# EAGLE design core v1-1 (EAGLE 6.1)

## Sheet 1 of 3
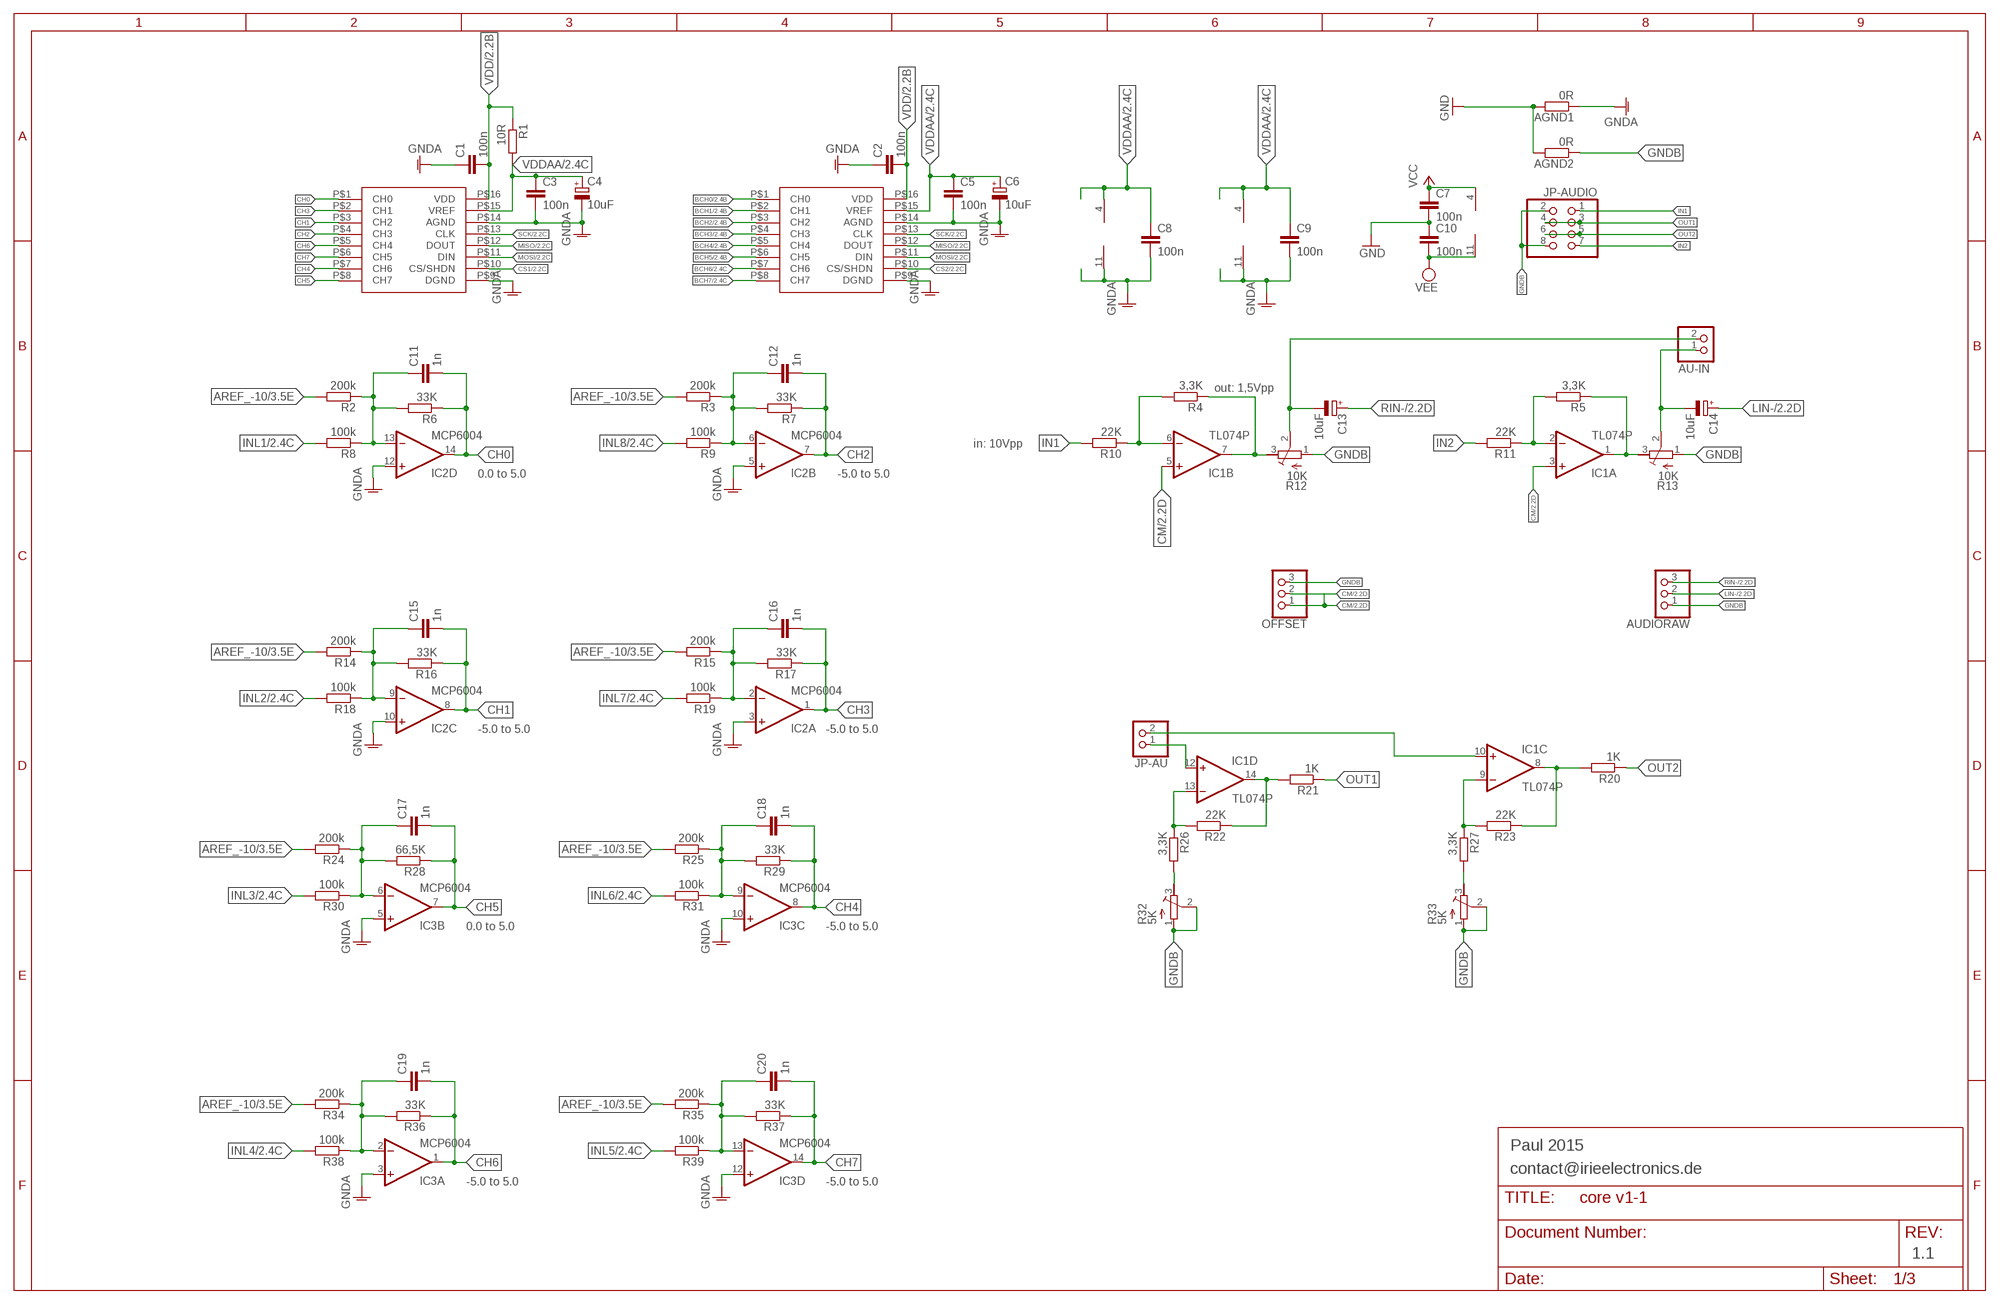
[diagram p0: schematic, sheet 1]

### Parts
AGND1  0R  R-EU_0207/7  [0207/7]
AGND2  0R  R-EU_0207/7  [0207/7]
AU-IN  PINHD-1X2_2.54-SMD-90°  [1X02SMD/90]
AUDIORAW  PINHD-1X3_2.54-SMD-90°  [1X03SMD/90]
C1  100n  C-EU025-025X050  [C025-025X050]
C2  100n  C-EU025-025X050  [C025-025X050]
C3  100n  C-EU025-025X050  [C025-025X050]
C4  10uF  CPOL-EUE1.8-4  [E1,8-4]
C5  100n  C-EU025-025X050  [C025-025X050]
C6  10uF  CPOL-EUE1.8-4  [E1,8-4]
C7  100n  C-EU025-025X050  [C025-025X050]
C8  100n  C-EU025-025X050  [C025-025X050]
C9  100n  C-EU025-025X050  [C025-025X050]
C10  100n  C-EU025-025X050  [C025-025X050]
C11  1n  C-EU050-025X075  [C050-025X075]
C12  1n  C-EU050-025X075  [C050-025X075]
C13  10uF  CPOL-EUE1.8-4  [E1,8-4]
C14  10uF  CPOL-EUE1.8-4  [E1,8-4]
C15  1n  C-EU050-025X075  [C050-025X075]
C16  1n  C-EU050-025X075  [C050-025X075]
C17  1n  C-EU050-025X075  [C050-025X075]
C18  1n  C-EU050-025X075  [C050-025X075]
C19  1n  C-EU050-025X075  [C050-025X075]
C20  1n  C-EU050-025X075  [C050-025X075]
IC1  TL074P  [DIL14]
IC2  MCP6004  TL074P  [DIL14]
IC3  MCP6004  TL074P  [DIL14]
JP-AU  PINHD-1X2_2.54  [1X02]
JP-AUDIO  PINHD-2X4_2.54  [2X04]
OFFSET  PINHD-1X3_2.54-SMD-90°  [1X03SMD/90]
R1  10R  R-EU_0207/7  [0207/7]
R2  200k  R-EU_0207/7  [0207/7]
R3  200k  R-EU_0207/7  [0207/7]
R4  3,3K  R-EU_0207/7  [0207/7]
R5  3,3K  R-EU_0207/7  [0207/7]
R6  33K  R-EU_0207/7  [0207/7]
R7  33K  R-EU_0207/7  [0207/7]
R8  100k  R-EU_0207/7  [0207/7]
R9  100k  R-EU_0207/7  [0207/7]
R10  22K  R-EU_0207/7  [0207/7]
R11  22K  R-EU_0207/7  [0207/7]
R12  10K  R-TRIMM3296P  [RTRIM3296P]
R13  10K  R-TRIMM3296P  [RTRIM3296P]
R14  200k  R-EU_0207/7  [0207/7]
R15  200k  R-EU_0207/7  [0207/7]
R16  33K  R-EU_0207/7  [0207/7]
R17  33K  R-EU_0207/7  [0207/7]
R18  100k  R-EU_0207/7  [0207/7]
R19  100k  R-EU_0207/10  [0207/10]
R20  1K  R-EU_0207/7  [0207/7]
R21  1K  R-EU_0207/7  [0207/7]
R22  22K  R-EU_0207/10  [0207/10]
R23  22K  R-EU_0207/7  [0207/7]
R24  200k  R-EU_0207/10  [0207/10]
R25  200k  R-EU_0207/7  [0207/7]
R26  3,3K  R-EU_0207/10  [0207/10]
R27  3,3K  R-EU_0207/7  [0207/7]
R28  66,5K  R-EU_0207/7  [0207/7]
R29  33K  R-EU_0207/7  [0207/7]
R30  100k  R-EU_0207/7  [0207/7]
R31  100k  R-EU_0207/7  [0207/7]
R32  5K  R-TRIMM3296P  [RTRIM3296P]
R33  5K  R-TRIMM3296P  [RTRIM3296P]
R34  200k  R-EU_0207/10  [0207/10]
R35  200k  R-EU_0207/7  [0207/7]
R36  33K  R-EU_0207/7  [0207/7]
R37  33K  R-EU_0207/7  [0207/7]
R38  100k  R-EU_0207/7  [0207/7]
R39  100k  R-EU_0207/7  [0207/7]
U$1  MCP3208_DIP  [MCP2308]
U$2  MCP3208_DIP  [MCP2308]

### Nets
AREF_-10: R2.2 R3.2 R14.2 R15.2 R24.2 R25.2 R34.2 R35.2 ; also sheet 3
BCH0: U$2.P$1(CH0) ; also sheet 2
BCH1: U$2.P$2(CH1) ; also sheet 2
BCH2: U$2.P$3(CH2) ; also sheet 2
BCH3: U$2.P$4(CH3) ; also sheet 2
BCH4: U$2.P$5(CH4) ; also sheet 2
BCH5: U$2.P$6(CH5) ; also sheet 2
BCH6: U$2.P$7(CH6) ; also sheet 2
BCH7: U$2.P$8(CH7) ; also sheet 2
CH0: C11.2 IC2.14(D:OUT) R6.1 U$1.P$1(CH0)
CH1: C15.2 IC2.8(C:OUT) R16.1 U$1.P$3(CH2)
CH2: C12.2 IC2.7(B:OUT) R7.1 U$1.P$4(CH3)
CH3: C16.2 IC2.1(A:OUT) R17.1 U$1.P$2(CH1)
CH4: C18.2 IC3.8(C:OUT) R29.1 U$1.P$7(CH6)
CH5: C17.2 IC3.7(B:OUT) R28.1 U$1.P$8(CH7)
CH6: C19.2 IC3.1(A:OUT) R36.1 U$1.P$5(CH4)
CH7: C20.2 IC3.14(D:OUT) R37.1 U$1.P$6(CH5)
CM: IC1.3(A:+IN) IC1.5(B:+IN) OFFSET.1 OFFSET.2 ; also sheet 2
CS1: U$1.P$10(CS/SHDN) ; also sheet 2
CS2: U$2.P$10(CS/SHDN) ; also sheet 2
GND: AGND1.2 AGND2.2 C7.2 C10.1 ; also sheet 2,3
GNDA: AGND1.1 C1.1 C2.1 C3.2 C4.- C5.2 C6.- C8.2 C9.2 IC2.3(A:+IN) IC2.5(B:+IN) IC2.10(C:+IN) IC2.11(P:V-) IC2.12(D:+IN) IC3.3(A:+IN) IC3.5(B:+IN) IC3.10(C:+IN) IC3.11(P:V-) IC3.12(D:+IN) U$1.P$9(DGND) U$1.P$14(AGND) U$2.P$9(DGND) U$2.P$14(AGND) ; also sheet 2,3
GNDB: AGND2.1 AUDIORAW.1 JP-AUDIO.2 JP-AUDIO.8 OFFSET.3 R12.1(E) R13.1(E) R32.1(E) R32.2(S) R33.1(E) R33.2(S)
IN1: JP-AUDIO.1 R10.2
IN2: JP-AUDIO.7 R11.2
INL1: R8.2 ; also sheet 2
INL2: R18.2 ; also sheet 2
INL3: R30.2 ; also sheet 2
INL4: R38.2 ; also sheet 2
INL5: R39.2 ; also sheet 2
INL6: R31.2 ; also sheet 2
INL7: R19.2 ; also sheet 2
INL8: R9.2 ; also sheet 2
LIN-: AUDIORAW.2 C14.+ ; also sheet 2
MISO: U$1.P$12(DOUT) U$2.P$12(DOUT) ; also sheet 2
MOSI: U$1.P$11(DIN) U$2.P$11(DIN) ; also sheet 2
N$2: C15.1 IC2.9(C:-IN) R14.1 R16.2 R18.1
N$4: R26.2 R32.3(A)
N$5: C16.1 IC2.2(A:-IN) R15.1 R17.2 R19.1
N$6: IC1.13(D:-IN) R22.2 R26.1
N$7: IC1.14(D:OUT) R21.2 R22.1
N$8: AU-IN.2 C13.- R12.2(S)
N$9: R27.2 R33.3(A)
N$10: IC1.9(C:-IN) R23.2 R27.1
N$11: C11.1 IC2.13(D:-IN) R2.1 R6.2 R8.1
N$12: IC1.8(C:OUT) R20.2 R23.1
N$13: IC1.10(C:+IN) JP-AU.2
N$14: IC1.12(D:+IN) JP-AU.1
N$15: C12.1 IC2.6(B:-IN) R3.1 R7.2 R9.1
N$16: AU-IN.1 C14.- R13.2(S)
N$17: IC1.6(B:-IN) R4.2 R10.1
N$18: C19.1 IC3.2(A:-IN) R34.1 R36.2 R38.1
N$19: IC1.7(B:OUT) R4.1 R12.3(A)
N$20: C20.1 IC3.13(D:-IN) R35.1 R37.2 R39.1
N$21: IC1.2(A:-IN) R5.2 R11.1
N$22: C17.1 IC3.6(B:-IN) R24.1 R28.2 R30.1
N$23: IC1.1(A:OUT) R5.1 R13.3(A)
N$24: C18.1 IC3.9(C:-IN) R25.1 R29.2 R31.1
OUT1: JP-AUDIO.3 JP-AUDIO.4 R21.1
OUT2: JP-AUDIO.5 JP-AUDIO.6 R20.1
RIN-: AUDIORAW.3 C13.+ ; also sheet 2
SCK: U$1.P$13(CLK) U$2.P$13(CLK) ; also sheet 2
VCC: C7.1 IC1.4(P:V+) ; also sheet 3
VDD: C1.2 C2.2 R1.1 U$1.P$16(VDD) U$2.P$16(VDD) ; also sheet 2
VDDAA: C3.1 C4.+ C5.1 C6.+ C8.1 C9.1 IC2.4(P:V+) IC3.4(P:V+) R1.2 U$1.P$15(VREF) U$2.P$15(VREF) ; also sheet 2
VEE: C10.2 IC1.11(P:V-) ; also sheet 3

### Notes on the sheet
- out: 1,5Vpp
- in: 10Vpp
- 0.0 to 5.0 | -5.0 to 5.0
- -5.0 to 5.0 | -5.0 to 5.0
- 0.0 to 5.0 | -5.0 to 5.0
- Paul 2015
- contact@irieelectronics.de
- -5.0 to 5.0 | -5.0 to 5.0
- 1.1

## Sheet 2 of 3
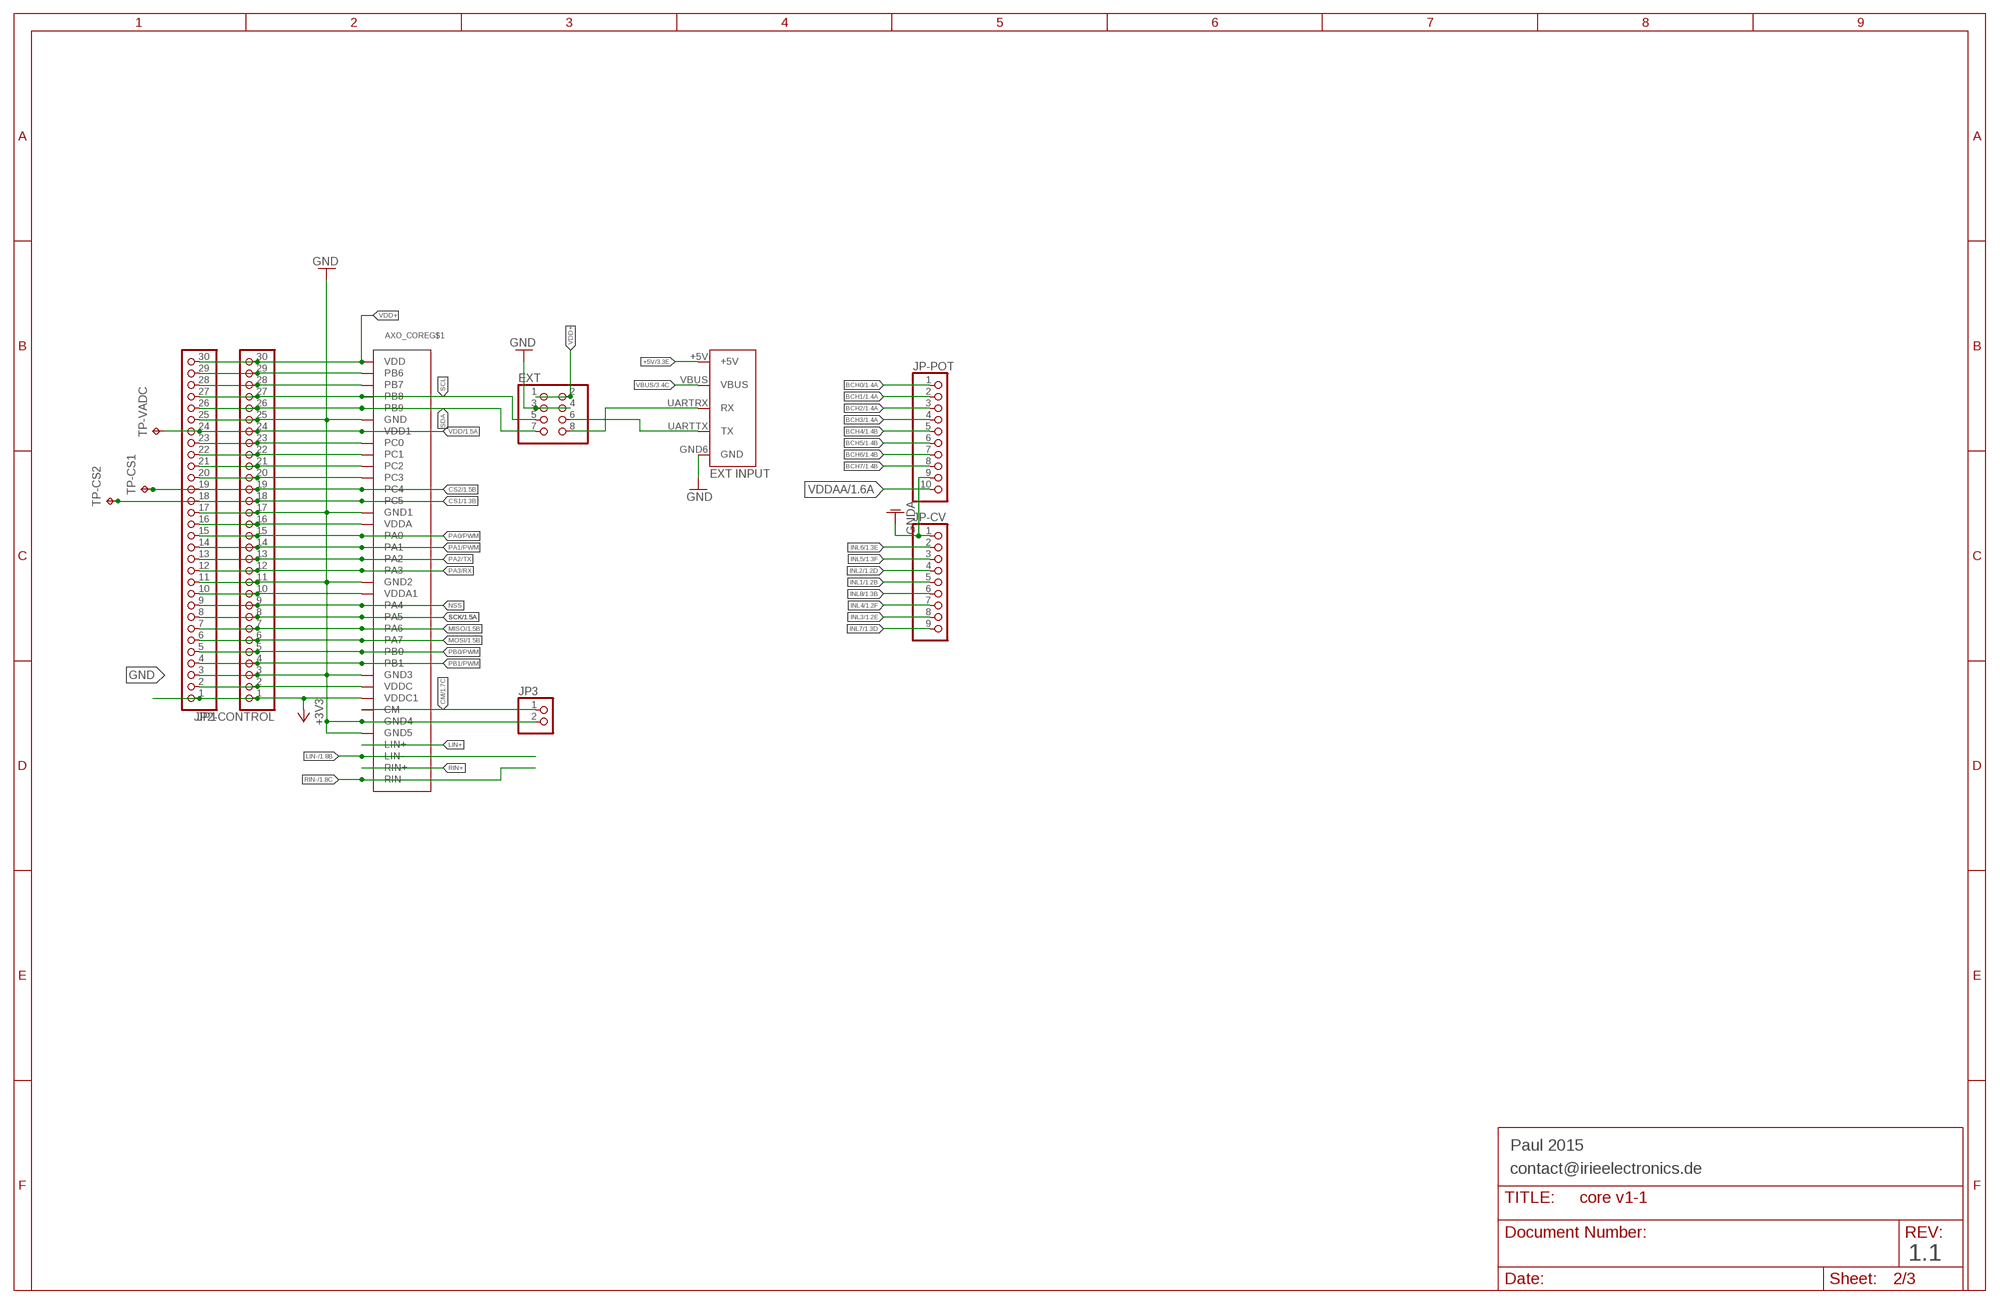
[diagram p1: schematic, sheet 2]

### Parts
AXO_CORE  AXO-CORE  AXOLOTI-CORE  [AXOLOTI-CORE]
EXT  PINHD-2X4_2.54  [2X04]
JP1  PINHD-1X30  [1X30]
JP2-CONTROL  PINHD-1X30  [1X30]
JP3  PINHD-1X2_2.54  [1X02]
JP-CV  PINHD-1X9_2.54  [1X09]
JP-POT  PINHD-1X10_2.54  [1X10]
TP-CS1  TPTP10R  [TP10R]
TP-CS2  TPTP10R  [TP10R]
TP-VADC  TPTP10R  [TP10R]

### Nets
+3V3: AXO_CORE.VDDC1 JP1.1 JP2-CONTROL.1
+5V: AXO_CORE.+5V ; also sheet 3
BCH0: JP-POT.1 ; also sheet 1
BCH1: JP-POT.2 ; also sheet 1
BCH2: JP-POT.3 ; also sheet 1
BCH3: JP-POT.4 ; also sheet 1
BCH4: JP-POT.5 ; also sheet 1
BCH5: JP-POT.6 ; also sheet 1
BCH6: JP-POT.7 ; also sheet 1
BCH7: JP-POT.8 ; also sheet 1
CM: AXO_CORE.CM JP3.1 ; also sheet 1
CS1: AXO_CORE.PC5 JP1.18 JP2-CONTROL.18 TP-CS2.TP ; also sheet 1
CS2: AXO_CORE.PC4 JP1.19 JP2-CONTROL.19 TP-CS1.TP ; also sheet 1
GND: AXO_CORE.GND AXO_CORE.GND1 AXO_CORE.GND2(GND3) AXO_CORE.GND3(GND2) AXO_CORE.GND4 AXO_CORE.GND5 AXO_CORE.GND6(GND) EXT.3 EXT.4 JP1.3 JP1.11 JP1.17 JP1.25 JP2-CONTROL.3 JP2-CONTROL.11 JP2-CONTROL.17 JP2-CONTROL.25 JP3.2 ; also sheet 1,3
GNDA: JP-CV.1 JP-POT.9 ; also sheet 1,3
INL1: JP-CV.5 ; also sheet 1
INL2: JP-CV.4 ; also sheet 1
INL3: JP-CV.8 ; also sheet 1
INL4: JP-CV.7 ; also sheet 1
INL5: JP-CV.3 ; also sheet 1
INL6: JP-CV.2 ; also sheet 1
INL7: JP-CV.9 ; also sheet 1
INL8: JP-CV.6 ; also sheet 1
LIN+: AXO_CORE.LIN+
LIN-: AXO_CORE.LIN- ; also sheet 1
MIDI/RX: AXO_CORE.UARTRX(RX) EXT.8
MIDI/TX: AXO_CORE.UARTTX(TX) EXT.6
MISO: AXO_CORE.PA6 JP1.7 JP2-CONTROL.7 ; also sheet 1
MOSI: AXO_CORE.PA7 JP1.6 JP2-CONTROL.6 ; also sheet 1
N$29: AXO_CORE.VDDC JP1.2 JP2-CONTROL.2
N$32: AXO_CORE.VDDA1 JP1.10 JP2-CONTROL.10
N$38: AXO_CORE.VDDA JP1.16 JP2-CONTROL.16
N$42: AXO_CORE.PC3 JP1.20 JP2-CONTROL.20
N$43: AXO_CORE.PC2 JP1.21 JP2-CONTROL.21
N$44: AXO_CORE.PC1 JP1.22 JP2-CONTROL.22
N$45: AXO_CORE.PC0 JP1.23 JP2-CONTROL.23
N$50: AXO_CORE.PB7 JP1.28 JP2-CONTROL.28
N$51: AXO_CORE.PB6 JP1.29 JP2-CONTROL.29
NSS: AXO_CORE.PA4 JP1.9 JP2-CONTROL.9
PA0/PWM: AXO_CORE.PA0 JP1.15 JP2-CONTROL.15
PA1/PWM: AXO_CORE.PA1 JP1.14 JP2-CONTROL.14
PA2/TX: AXO_CORE.PA2 JP1.13 JP2-CONTROL.13
PA3/RX: AXO_CORE.PA3 JP1.12 JP2-CONTROL.12
PB0/PWM: AXO_CORE.PB0 JP1.5 JP2-CONTROL.5
PB1/PWM: AXO_CORE.PB1 JP1.4 JP2-CONTROL.4
RIN+: AXO_CORE.RIN+
RIN-: AXO_CORE.RIN- ; also sheet 1
SCK: AXO_CORE.PA5 JP1.8 JP2-CONTROL.8 ; also sheet 1
SCL: AXO_CORE.PB8 EXT.5 JP1.27 JP2-CONTROL.27
SDA: AXO_CORE.PB9 EXT.7 JP1.26 JP2-CONTROL.26
VBUS: AXO_CORE.VBUS ; also sheet 3
VDD: AXO_CORE.VDD1 JP1.24 JP2-CONTROL.24 TP-VADC.TP ; also sheet 1
VDD+: AXO_CORE.VDD EXT.1 EXT.2 JP1.30 JP2-CONTROL.30
VDDAA: JP-POT.10 ; also sheet 1

### Notes on the sheet
- Paul 2015
- contact@irieelectronics.de
- 1.1

## Sheet 3 of 3
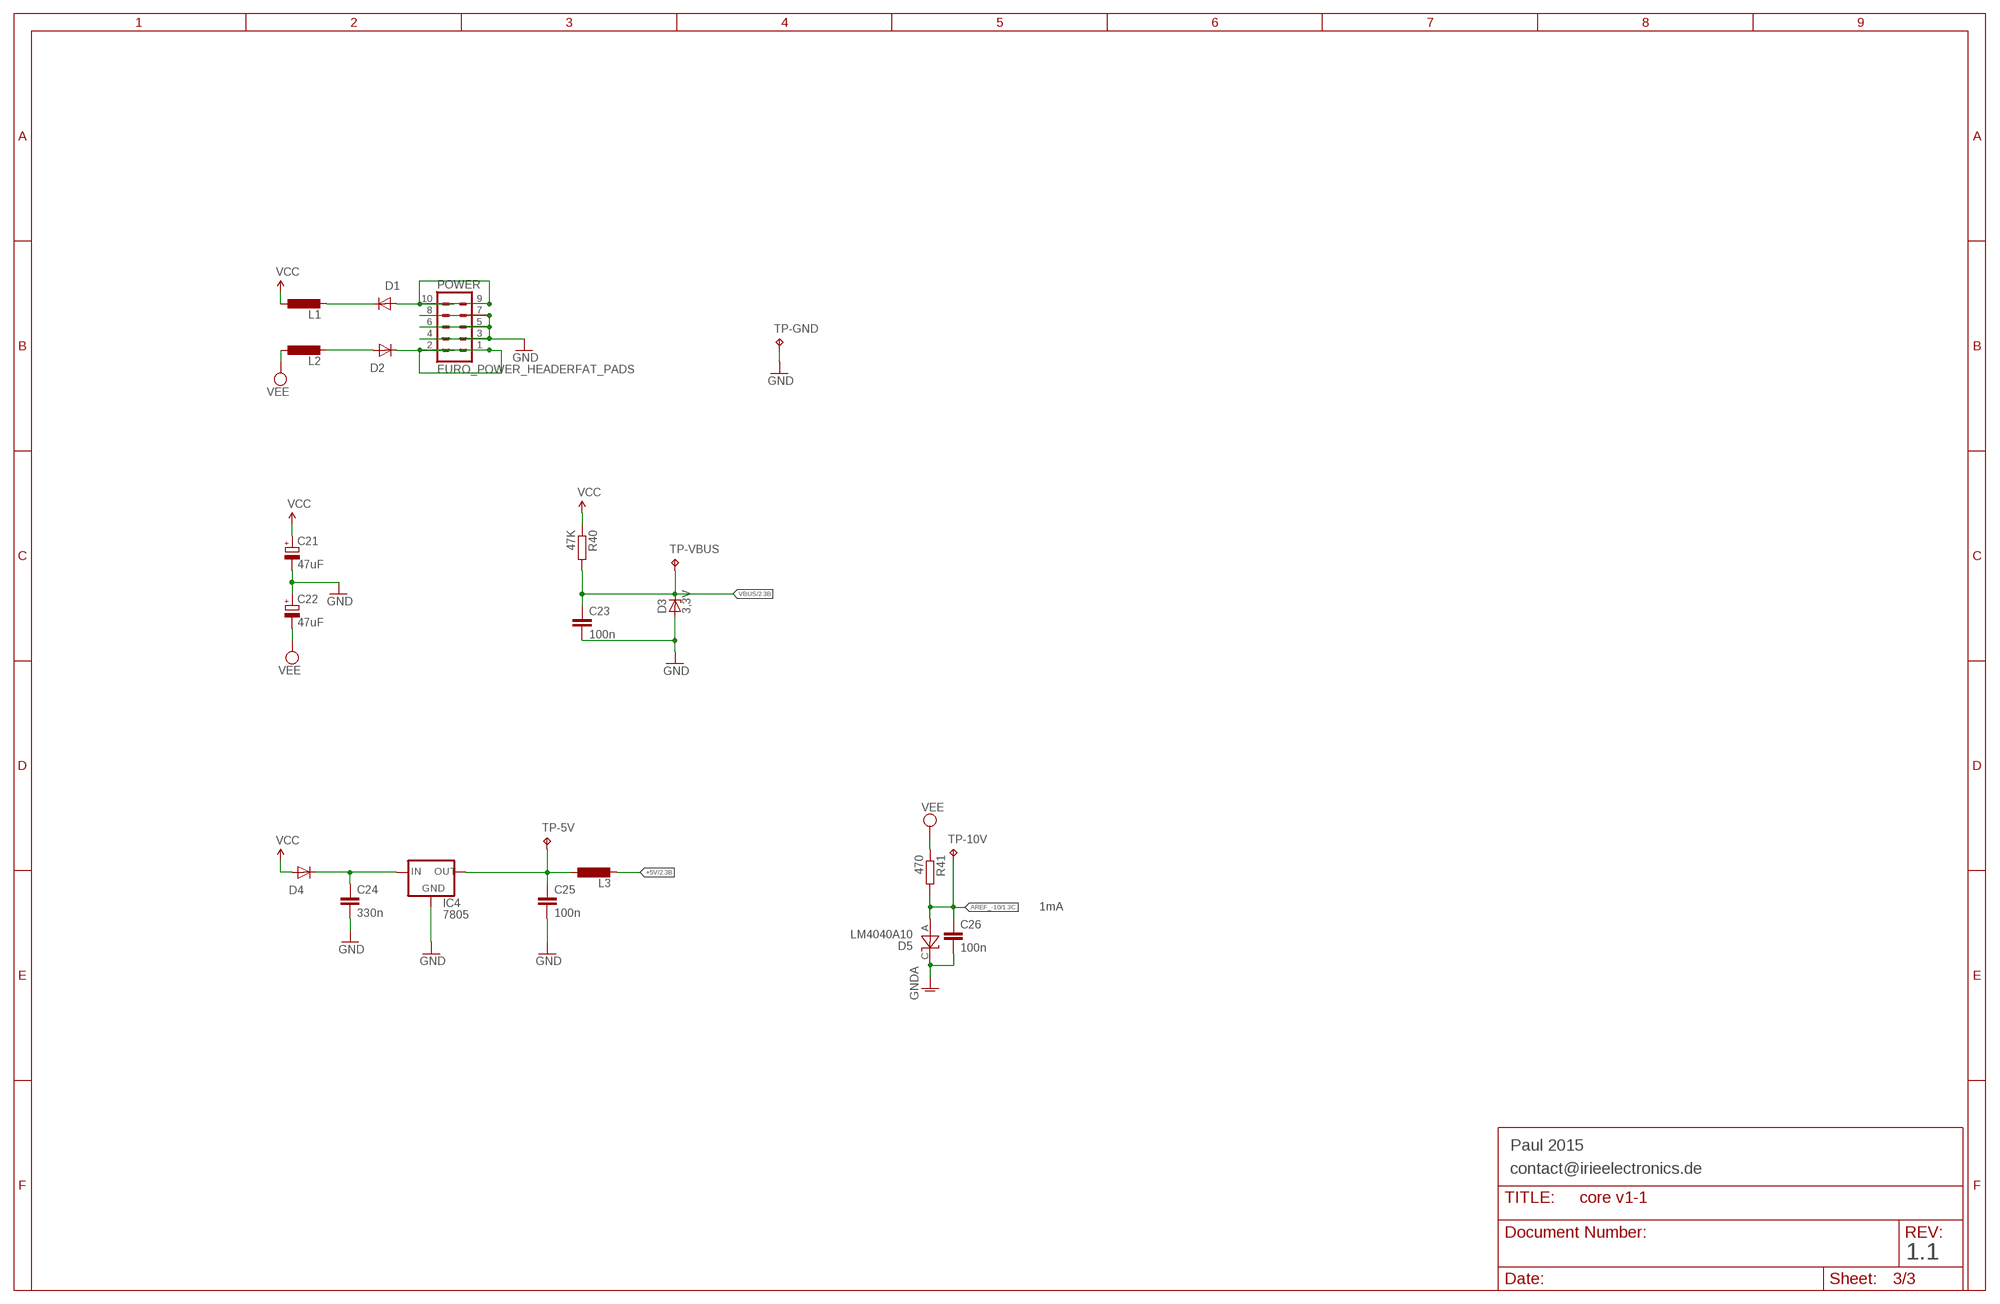
[diagram p2: schematic, sheet 3]

### Parts
C21  47uF  CPOL-EUE2-5  [E2-5]
C22  47uF  CPOL-EUE2-5  [E2-5]
C23  100n  C-EU025-025X050  [C025-025X050]
C24  330n  C-EU025-025X050  [C025-025X050]
C25  100n  C-EU025-025X050  [C025-025X050]
C26  100n  C-EU025-025X050  [C025-025X050]
D1  1N5819  1N4148DO35-10  [DO35-10]
D2  1N5819  1N4148DO35-10  [DO35-10]
D3  3,3V  1N821  [DO35Z10]
D4  1N5819HW  1N4148DO35-10  [DO35-10]
D5  LM4040A10  LM4040DIP  [TO-92]
IC4  7805  78MXXS  [78MXXS]
L1  L-EU0207/10  [0207/10]
L2  L-EU0207/10  [0207/10]
L3  L-EU0207/10  [0207/10]
POWER  EURO_POWER_HEADERFAT_PADS  [EURO_PWR_HEADER_FAT]
R40  47K  R-EU_0207/7  [0207/7]
R41  470  R-EU_0207/10  [0207/10]
TP-5V  TPTP10R  [TP10R]
TP-10V  TPTP10R  [TP10R]
TP-GND  TPPAD1-13  [P1-13]
TP-VBUS  TPTP10R  [TP10R]

### Nets
+5V: L3.2 ; also sheet 2
+5V_RAW: C25.1 IC4.OUT L3.1 TP-5V.TP
AREF_-10: C26.1 D5.A R41.2 TP-10V.TP ; also sheet 1
GND: C21.- C22.+ C23.2 C24.2 C25.2 D3.A IC4.GND POWER.3 POWER.4 POWER.5 POWER.6 POWER.7 POWER.8 TP-GND.TP ; also sheet 1,2
GNDA: C26.2 D5.C ; also sheet 1,2
N$1: D1.C L1.2
N$3: D2.A L2.2
N$25: C24.1 D4.C IC4.IN
N$56: D1.A POWER.9 POWER.10
N$64: D2.C POWER.1 POWER.2
VBUS: C23.1 D3.C R40.2 TP-VBUS.TP ; also sheet 2
VCC: C21.+ D4.A L1.1 R40.1 ; also sheet 1
VEE: C22.- L2.1 R41.1 ; also sheet 1

### Notes on the sheet
- 1mA
- Paul 2015
- contact@irieelectronics.de
- 1.1

## Library data of the parts
AGND1 AGND2 R1-R11 R14-R31 R34-R41 = resistor-mod:R-EU_: RESISTOR, European symbol
AU-IN JP3 JP-AU = pinhead 2:PINHD-1X2: PIN HEADER
AUDIORAW OFFSET = pinhead 2:PINHD-1X3: PIN HEADER
AXO_CORE = axoloti core:AXOLOTI-CORE
C1-C3 C5 C7-C12 C15-C20 C23-C26 = resistor-mod:C-EU: CAPACITOR, European symbol
C4 C6 C13 C14 C21 C22 = resistor-mod:CPOL-EU: POLARIZED CAPACITOR, European symbol
D1 D2 D4 = diode:1N4148: DIODE high speed (Philips)
D3 = diode:1N821: Reference DIODE temperature compensated, 6,2 V
D5 = GuShH:LM4040
EXT JP-AUDIO = pinhead 2:PINHD-2X4: PIN HEADER
IC1-IC3 = linear:TL074: OP AMP
IC4 = v-reg:78MXXS: VOLTAGE REGULATOR
JP1 JP2-CONTROL = pinhead:PINHD-1X30: PIN HEADER
JP-CV = pinhead 2:PINHD-1X9: PIN HEADER
JP-POT = pinhead 2:PINHD-1X10: PIN HEADER
L1-L3 = resistor-mod:L-EU: INDUCTOR, European symbol
POWER = MusicThingModular mod:EURO_POWER_HEADER: Power Header 10 pin power header for Eurorack Power Supplies Variants with fatter pads for easier soldering, and the LOCK variant which has 5mil offset pins to hold the component in place before soldering
R12 R13 R32 R33 = resistor-mod:R-TRIMM: Trimm resistor
TP-5V TP-10V TP-CS1 TP-CS2 TP-GND TP-VADC TP-VBUS = testpad:TP: Test pad
U$1 U$2 = mcp2308:MCP3208_DIP: MCP3208 DIP

## Board
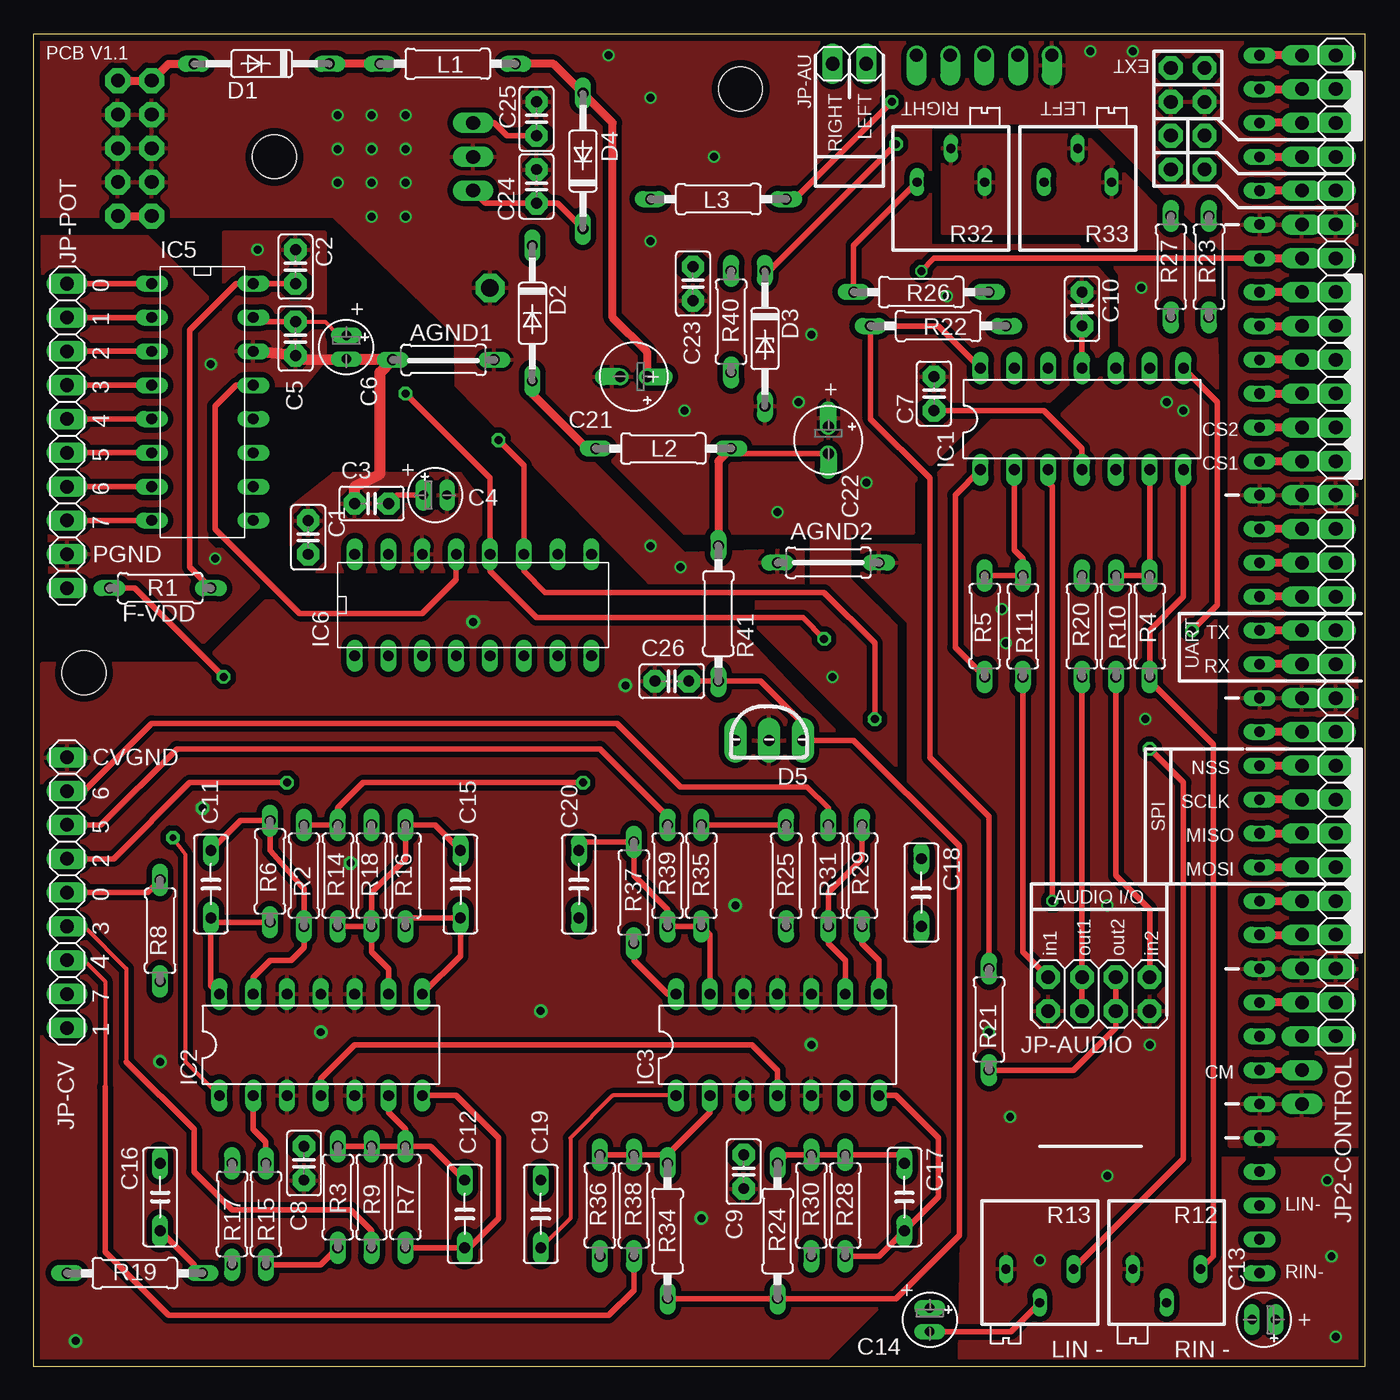
[diagram p3: board, top side]
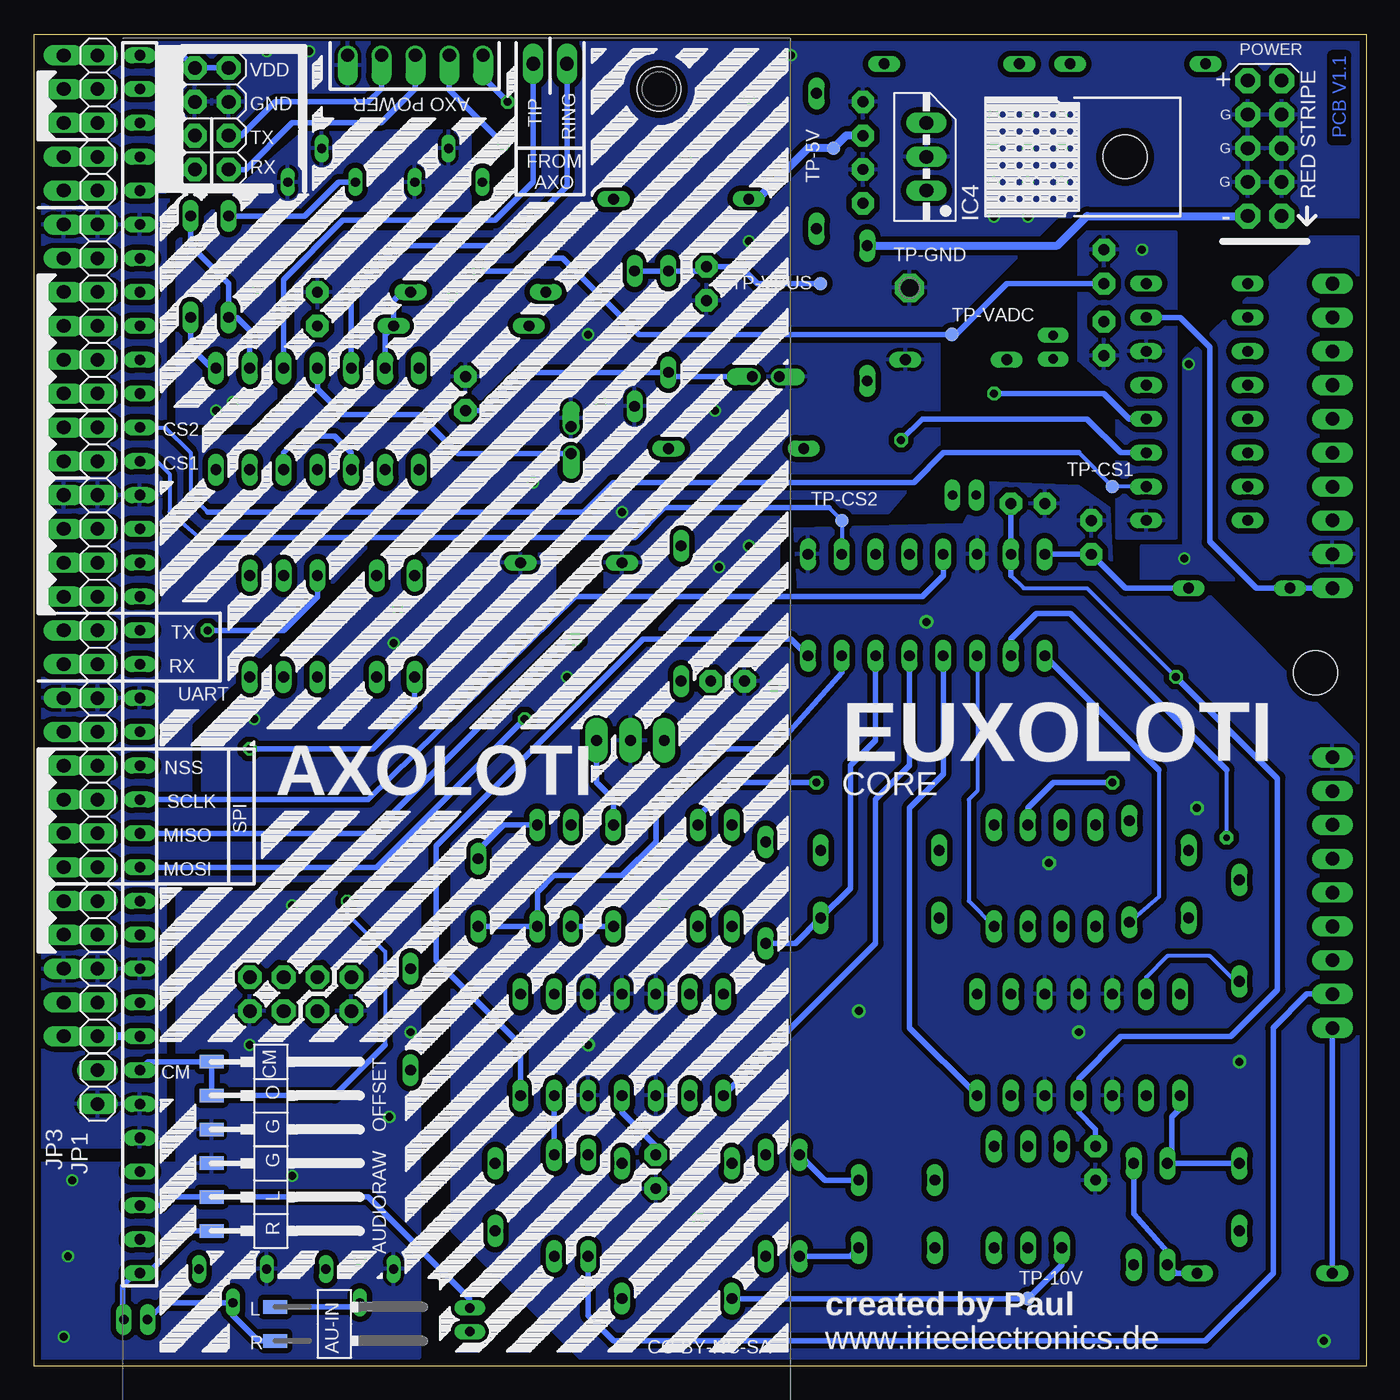
[diagram p4: board, bottom side, seen from below]

Size 100 x 100 mm. Coordinates in mm from the lower left corner, seen from the top.
Outline: 0,0 100,0 100,100 0,100 0,0
Copper layers (1*2*15*16): Top 0.035mm / dielectric 0.2mm / Route2 0.035mm / dielectric 1.2mm / Route15 0.035mm / dielectric 0.2mm / Bottom 0.035mm
Design rules: minimum track width 6mil, minimum drill 12mil, track to track 6mil, track to pad 8mil, pad to pad 12mil, via to via 6mil, smd to smd 0mil, copper to edge 20mil, drill to drill 10mil, minimum pad ring 6mil, minimum via ring 6mil, stop-mask expansion 0mil, vias tented up to drill 100mil, thermal gap 10mil
Holes 3.3 mm at 53.1,95.89 18.1,90.81 3.81,52.07

### Footprints (pad centres in the part's own frame; a part is rotated, then mirrored left to right if it is on the bottom)
0207/7 = drill 0.813 long: 1 -3.81,0; 2 3.81,0
1X02SMD/90 = smd 1.016 x 1.778: 1 -1.27,-5.08; 2 1.27,-5.08
1X03SMD/90 = smd 1.016 x 1.778: 1 -1.27,-5.08; 2 1.27,-5.08; 3 3.81,-5.08
AXOLOTI-CORE = drill 1 offset: +5V 107.315,23.13; GND6 107.315,33.29; UARTRX 107.315,28.21; UARTTX 107.315,30.75; VBUS 107.315,25.67 | drill 0.8 long: CM 31.115,48.895; GND 94.615,48.895; GND1 74.295,48.895; GND2 38.735,48.895; GND3 59.055,48.895; GND4 28.575,48.895; GND5 26.035,48.895; LIN+ 23.495,48.895; LIN- 20.955,48.895; PA0 69.215,48.895; PA1 66.675,48.895; PA2 64.135,48.895; PA3 61.595,48.895; PA4 53.975,48.895; PA5 51.435,48.895; PA6 48.895,48.895; PA7 46.355,48.895; PB0 43.815,48.895; PB1 41.275,48.895; PB6 104.775,48.895; PB7 102.235,48.895; PB8 99.695,48.895; PB9 97.155,48.895; PC0 89.535,48.895; PC1 86.995,48.895; PC2 84.455,48.895; PC3 81.915,48.895; PC4 79.375,48.895; PC5 76.835,48.895; RIN+ 18.415,48.895; RIN- 15.875,48.895; VDD 107.315,48.895; VDD1 92.075,48.895; VDDA 71.755,48.895; VDDA1 56.515,48.895; VDDC 36.195,48.895; VDDC1 33.655,48.895
C025-025X050 = drill 0.813 pad 1.676 octagon: 1 -1.27,0; 2 1.27,0
E1,8-4 = drill 0.711 pad 1.168 long: + -0.889,0; - 0.889,0
C050-025X075 = drill 0.813 long: 1 -2.54,0; 2 2.54,0
E2-5 = drill 0.813 pad 1.27 offset: + -1.016,0; - 1.016,0
DO35-10 = drill 0.813 long: A 5.08,0; C -5.08,0
DO35Z10 = drill 0.813 long: A 5.08,0; C -5.08,0
TO-92 = drill 0.813 pad 1.676 long: A 2.54,0.318; C 0,0.318; NC -2.54,0.318
2X04 = drill 1.016 pad 1.778 octagon: 1 -3.81,-1.27; 2 -3.81,1.27; 3 -1.27,-1.27; 4 -1.27,1.27; 5 1.27,-1.27; 6 1.27,1.27; 7 3.81,-1.27; 8 3.81,1.27
DIL14 = drill 0.813 long: 1 -7.62,-3.81; 2 -5.08,-3.81; 3 -2.54,-3.81; 4 0,-3.81; 5 2.54,-3.81; 6 5.08,-3.81; 7 7.62,-3.81; 8 7.62,3.81; 9 5.08,3.81; 10 2.54,3.81; 11 0,3.81; 12 -2.54,3.81; 13 -5.08,3.81; 14 -7.62,3.81
78MXXS = drill 1.016 long: GND 0,-2.54; IN -2.54,-2.54; OUT 2.54,-2.54
1X30 = drill 1.016 long: 1 -36.83,0; 2 -34.29,0; 3 -31.75,0; 4 -29.21,0; 5 -26.67,0; 6 -24.13,0; 7 -21.59,0; 8 -19.05,0; 9 -16.51,0; 10 -13.97,0; 11 -11.43,0; 12 -8.89,0; 13 -6.35,0; 14 -3.81,0; 15 -1.27,0; 16 1.27,0; 17 3.81,0; 18 6.35,0; 19 8.89,0; 20 11.43,0; 21 13.97,0; 22 16.51,0; 23 19.05,0; 24 21.59,0; 25 24.13,0; 26 26.67,0; 27 29.21,0; 28 31.75,0; 29 34.29,0; 30 36.83,0
1X02 = drill 1.016 long: 1 -1.27,0; 2 1.27,0
1X09 = drill 1.016 long: 1 -10.16,0; 2 -7.62,0; 3 -5.08,0; 4 -2.54,0; 5 0,0; 6 2.54,0; 7 5.08,0; 8 7.62,0; 9 10.16,0
1X10 = drill 1.016 long: 1 -11.43,0; 2 -8.89,0; 3 -6.35,0; 4 -3.81,0; 5 -1.27,0; 6 1.27,0; 7 3.81,0; 8 6.35,0; 9 8.89,0; 10 11.43,0
0207/10 = drill 0.813 long: 1 -5.08,0; 2 5.08,0
EURO_PWR_HEADER_FAT = drill 1.016 pad 1.88 octagon: 1 -5.08,-1.27; 2 -5.08,1.27; 3 -2.54,-1.27; 4 -2.54,1.27; 5 0,-1.27; 6 0,1.27; 7 2.54,-1.27; 8 2.54,1.27; 9 5.08,-1.27; 10 5.08,1.27
RTRIM3296P = drill 0.7 long: 1 0,-2.54; 2 2.54,0; 3 0,2.54
TP10R = smd 1 x 1: TP 0,0
P1-13 = drill 1.321 pad 2.159 octagon: TP 0,0
MCP2308 = drill 0.8 long: P$1 -3.81,7.62; P$2 -3.81,5.08; P$3 -3.81,2.54; P$4 -3.81,0; P$5 -3.81,-2.54; P$6 -3.81,-5.08; P$7 -3.81,-7.62; P$8 -3.81,-10.16; P$9 3.81,-10.16; P$10 3.81,-7.62; P$11 3.81,-5.08; P$12 3.81,-2.54; P$13 3.81,0; P$14 3.81,2.54; P$15 3.81,5.08; P$16 3.81,7.62

### Placement (x,y rotation side)
AGND1  30.8,75.56 0 top
AGND2  59.69,60.33 180 top
AU-IN  76.83,3.17 270 bottom
AUDIORAW  81.6,13.97 270 bottom
AXO_CORE  43.18,-8.89 90 bottom
BOTTOM_ARTWORK  [LABEL_COREBOTTOM]  0,0 0 top
C1  20.64,62.23 270 top
C2  19.68,82.55 270 top
C3  25.4,64.77 180 top
C4  30.16,65.41 0 top
C5  19.68,77.15 270 top
C6  23.5,76.52 270 top
C7  67.63,73.03 90 top
C8  20.32,15.24 270 top
C9  53.34,14.61 270 top
C10  78.74,79.38 270 top
C11  13.34,36.2 270 top
C12  32.38,11.43 270 top
C13  92.39,3.49 180 top
C14  67.31,3.49 270 top
C15  32.07,36.2 270 top
C16  9.53,12.7 90 top
C17  65.41,12.7 270 top
C18  66.67,35.56 270 top
C19  38.1,11.43 270 top
C20  40.96,36.2 270 top
C21  45.09,74.3 180 top
C22  59.69,69.53 270 top
C23  49.53,81.28 270 top
C24  37.78,88.58 90 top
C25  37.78,93.66 90 top
C26  47.94,51.44 180 top
D1  17.14,97.79 180 top
D2  37.47,79.06 270 top
D3  54.93,77.15 270 top
D4  41.27,90.49 90 top
D5  55.24,46.67 0 top
EXT  86.68,93.66 270 bottom
IC1  78.74,71.12 0 top
IC2  21.59,24.13 0 top
IC3  55.88,24.13 0 top
IC4  35.56,90.81 90 bottom
JP1  95.25,61.59 90 bottom
JP2-CONTROL  97.79,61.59 90 top
JP3  95.25,20.95 270 bottom
JP-AU  61.28,97.79 0 top
JP-AUDIO  80.01,27.94 180 top
JP-CV  2.54,35.56 270 top
JP-POT  2.54,69.85 270 top
L1  31.11,97.79 180 top
L2  47.31,68.9 180 top
L3  51.44,87.63 0 top
OFFSET  81.6,21.59 270 bottom
POWER  7.62,91.44 90 bottom
R1  9.53,58.42 180 top
R2  20.32,36.83 90 top
R3  22.86,12.7 270 top
R4  83.82,55.56 90 top
R5  71.44,55.56 90 top
R6  17.78,37.15 90 top
R7  27.94,12.7 90 top
R8  9.53,32.7 90 top
R9  25.4,12.7 270 top
R10  81.28,55.56 270 top
R11  74.3,55.56 270 top
R12  85.09,7.3 270 top
R13  75.56,7.3 270 top
R14  22.86,36.83 90 top
R15  17.46,11.43 270 top
R16  27.94,36.83 90 top
R17  14.92,11.43 270 top
R18  25.4,36.83 90 top
R19  7.62,6.99 180 top
R20  78.74,55.56 90 top
R21  71.75,26.04 90 top
R22  67.94,78.11 0 top
R23  88.27,82.55 90 top
R24  55.88,10.16 270 top
R25  56.52,36.83 90 top
R26  66.67,80.64 180 top
R27  85.41,82.55 90 top
R28  60.96,12.06 90 top
R29  62.23,36.83 90 top
R30  58.42,12.06 270 top
R31  59.69,36.83 90 top
R32  68.9,88.9 90 top
R33  78.42,88.9 90 top
R34  47.62,10.16 270 top
R35  50.16,36.83 90 top
R36  42.55,12.06 90 top
R37  45.09,35.56 90 top
R38  45.09,12.06 270 top
R39  47.62,36.83 90 top
R40  52.39,78.42 90 top
R41  51.44,56.52 270 top
TP-5V  40.01,91.44 0 bottom
TP-10V  25.4,5.08 0 bottom
TP-CS1  19.05,66.04 0 bottom
TP-CS2  39.37,63.5 0 bottom
TP-GND  34.29,80.96 0 bottom
TP-VADC  31.11,77.47 180 bottom
TP-VBUS  40.96,81.28 0 bottom
U$1  31.75,57.15 90 top
U$2  12.7,73.66 0 top

### Tracks (layer width: path | path; a pad name or v marks a point on that pad's centre or on a via)
+3V3
  Bottom 0.61: AXO_CORE.VDDC1 JP1.1 JP2-CONTROL.1
+5V  (via drill 0.6 pad 1.02)
  Top 0.406: L3.2 57.15,87.63 v64.45,94.93
  Bottom 0.406: AXO_CORE.+5V 66.31,96.79 v64.45,94.93
+5V_RAW
  Top 0.406: C25.1 35.56,92.39 34.61,93.34 IC4.OUT
  Bottom 0.61: C25.1 39.05,92.39 TP-5V.TP 41.91,91.44 45.72,87.63 L3.1
AREF_-10  (via drill 0.6 pad 1.02)
  Top 0.406: C26.1 R41.2 54.61,51.44 57.78,48.26 57.78,47.31 58.1,46.99 | R15.2 21.59,7.62 R3.2 | 58.1,46.99 61.59,46.99 69.53,39.05 69.53,9.84 64.77,5.08 R24.2 R34.2 | R2.2 R14.2 22.86,41.91 24.77,43.81 v41.27,43.81 | R35.2 R25.2 | 58.1,46.99 D5.A
  Bottom 0.406: R34.2 TP-10V.TP 22.86,7.62 R3.2 | v41.27,43.81 47.62,43.81 50.16,41.27 R35.2 | R25.2 56.52,42.55 57.78,43.81 D5.A
BCH0
  Top 0.406: JP-POT.1 U$2.P$1
BCH1
  Top 0.406: U$2.P$2 JP-POT.2
BCH2
  Top 0.406: U$2.P$3 JP-POT.3
BCH3
  Top 0.406: U$2.P$4 JP-POT.4
BCH4
  Top 0.406: U$2.P$5 JP-POT.5
BCH5
  Top 0.406: JP-POT.6 U$2.P$6
BCH6
  Top 0.406: JP-POT.7 U$2.P$7
BCH7
  Top 0.406: U$2.P$8 JP-POT.8
CH0
  Top 0.406: IC2.14 13.34,28.57 C11.2 13.34,33.34 R6.1
  Bottom 0.305: 15.56,44.77 15.56,35.24 R6.1
  Bottom 0.406: 15.56,44.77 U$1.P$1
CH1
  Top 0.406: R16.1 27.94,33.66 C15.2 32.07,30.8 IC2.8
  Bottom 0.305: U$1.P$3 29.21,43.18 29.84,42.55 29.84,34.92 R16.1
CH2
  Top 0.406: R7.1 C12.2 32.7,8.89 34.92,11.11 34.92,12.06 34.92,17.14 31.75,20.32 IC2.7
  Bottom 0.406: U$1.P$4 31.75,44.45 34.29,41.91 34.29,25.4 IC2.7
CH3  (via drill 0.5 pad 1.02)
  Top 0.305: IC2.1 11.43,22.86 11.43,38.42 v10.48,39.69
  Bottom 0.305: v10.48,39.69 10.48,44.77
  Bottom 0.406: 10.48,44.77 22.23,56.52 24.77,56.52 26.67,54.61 U$1.P$2 | C16.2 R17.1 14.92,15.88 14.61,16.19 14.61,18.73 13.97,19.37 IC2.1
CH4
  Top 0.406: R29.1 62.23,31.75 63.5,30.48 IC3.8
  Bottom 0.406: U$1.P$7 39.37,52.07 44.45,46.35 48.26,46.35 53.34,41.91 53.34,39.37 55.88,36.83 60.96,36.83 62.23,35.56 R29.1 C18.2
CH5
  Top 0.406: IC3.7 64.77,20.32 67.94,17.14 67.94,12.7 C17.2 63.5,8.26 R28.1
  Bottom 0.406: U$1.P$8 43.18,54.61 54.29,54.61 69.85,39.05 69.85,30.48 63.5,24.13 IC3.7
CH6
  Top 0.305: IC3.1 43.5,20.32 40.32,17.14 40.32,11.11 C19.2
  Bottom 0.406: IC3.1 36.83,31.75 36.83,42.55 34.29,45.09 U$1.P$5 | R36.1 38.73,8.26 C19.2
CH7
  Top 0.406: R37.1 45.09,30.48 47.62,27.94 IC3.14
  Bottom 0.406: U$1.P$6 36.83,46.99 38.73,45.09 38.73,35.88 C20.2 42.86,31.75 R37.1
CM  (via drill 0.6)
  Top 0.406: IC1.3 76.2,66.36 76.52,66.04 v76.52,34.92 | JP3.1 AXO_CORE.CM
  Bottom 0.305: v76.52,34.92 76.52,33.97 73.66,31.11 73.66,24.13
  Bottom 0.406: IC1.3 76.2,68.58 77.47,69.85 80.01,69.85 81.28,68.58 IC1.5 | AXO_CORE.CM 91.44,22.86 OFFSET.1 OFFSET.2 77.47,20.32 73.66,24.13
CS1
  Top 0.61: AXO_CORE.PC5 JP1.18 JP2-CONTROL.18
  Bottom 0.305: AXO_CORE.PC5 90.81,67.94 89.85,66.99 89.85,64.14 87.63,62.23 87,62.23 | 40.32,64.45 TP-CS2.TP U$1.P$10
  Bottom 0.406: 87,62.23 54.93,62.23 52.7,64.45 40.32,64.45
CS2
  Top 0.61: JP2-CONTROL.19 JP1.19 AXO_CORE.PC4
  Bottom 0.305: AXO_CORE.PC4 90.17,70.48 88.27,68.58 88.27,65.41 87,64.14 | U$2.P$10 TP-CS1.TP 21.59,68.58
  Bottom 0.406: 21.59,68.58 31.75,68.58 33.97,66.36 56.52,66.36 58.74,64.14 87,64.14
GND  (via drill 0.6)
  other vias: 25.4,93.93 27.94,93.93 25.4,91.39 22.86,91.39 25.4,88.85 27.94,88.85 27.94,91.39 27.94,86.31 25.4,86.31 22.86,93.93 46.35,84.45 58.42,77.47 46.35,95.25 43.18,98.42 79.38,98.74 51.12,90.81 68.58,80.33 62.55,66.36 82.55,98.74 48.9,71.75 55.88,64.14 57.47,72.39 60.01,51.75 46.35,61.59 48.58,60.01 22.86,88.85
  pour Top (isolate 0.406): 0.32,99.69 99.69,99.69 99.69,16.51 89.85,16.51 89.85,83.19 79.69,93.34 67.31,93.34 67.31,84.14 78.42,84.14 80.64,81.6 80.64,76.52 76.2,72.39 72.07,72.39 66.04,66.36 66.04,62.55 48.9,62.55 35.88,75.56 31.75,75.56 31.75,77.47 22.54,86.36 0.32,86.36
  pour Bottom (isolate 0.406): 0.32,86.36 0.32,99.69 99.69,99.69 99.69,69.85 90.17,69.85 90.17,87.31 82.55,93.66 65.41,93.66 65.41,85.09 76.83,85.09 80.33,81.28 80.33,73.03 83.5,69.85 99.69,69.53 99.38,42.23 88.27,42.23 88.27,48.26 81.28,54.93 75.56,60.96 74.3,62.23 57.15,62.23 57.15,58.1 44.13,58.1 44.13,64.14 35.88,64.14 32.07,68.58 32.07,77.47 23.18,86.36
  pour Bottom (isolate 0.406): 99.69,16.51 90.17,16.51 90.17,36.51 70.48,36.51 70.48,39.37 52.39,57.47 59.37,57.47 74.93,42.23 99.69,42.23
  pour Top (isolate 0.406): 31.75,76.83 31.75,73.66 46.99,58.1 57.78,58.1 57.78,61.28 48.9,60.96 36.51,73.34 36.51,76.83
  pour Top (isolate 0.406): 58.42,64.14 58.42,58.1 54.29,58.1 54.29,55.56 64.77,45.09 64.77,55.56 61.28,59.05 61.28,64.14
GNDA  (via drill 0.6, 0.6 pad 1.02)
  Top 0.813: U$2.P$14 C5.2 19.94,75.56 C6.- 23.88,75.56 AGND1.1 26.04,74.61 26.04,66.99 24.13,66.04 C3.2
  other vias: 21.59,25.08 58.42,24.13 38.1,26.67 12.7,41.91 9.53,22.86 23.81,37.78 50.16,11.11 3.17,1.91 33.02,55.88 44.45,51.12 52.7,34.61 16.83,83.82 13.65,60.64 13.34,75.25
  pour Bottom (isolate 0.406): 0.32,0.32 58.74,0.32 68.58,10.16 68.58,39.37 57.15,50.8 51.44,57.15 33.02,57.15 33.02,60.96 14.92,60.96 0.32,46.35
  pour Top (isolate 0.406): 0.32,0.32 59.37,0.32 68.9,9.84 68.9,38.73 57.15,50.8 52.39,55.88 51.12,57.15 17.46,57.47 12.7,52.7 0.64,52.7 0.64,49.85
  pour Top (isolate 0.406): 20.32,73.66 21.91,75.56 21.91,85.09 14.29,85.09 14.29,73.66
  pour Top (isolate 0.406): 0.64,84.77 1.27,58.42 6.67,58.42 11.43,53.66 12.06,53.66 17.78,59.37 17.78,61.28 13.65,61.28 13.02,61.91 13.02,72.39 14.61,73.98 14.61,78.74 8.57,84.77
  pour Bottom (isolate 0.406): 0.32,84.77 0.32,59.05 16.83,59.05 16.83,61.59 13.65,61.59 13.65,75.56 4.13,84.77
  pour Bottom (isolate 0.406): 14.29,85.09 21.59,85.09 21.59,75.56 18.73,73.03 18.73,62.23 14.29,62.23
  pour Top (isolate 0.406): 19.37,64.45 19.37,59.69 35.24,59.69 35.24,62.87 32.07,66.99 22.54,66.99
  pour Bottom (isolate 0.406): 42.86,62.87 30.16,63.18 28.57,66.36 21.59,66.04 19.37,64.45 19.05,58.1 42.55,58.1
GNDB  (via drill 0.6)
  other vias: 86.36,71.75 80.64,14.29 83.82,24.13 97.16,13.97 97.79,2.22 97.47,8.26 75.56,7.94 83.19,80.96 80.64,34.61 71.75,25.08 85.09,72.39 72.71,56.83 83.5,48.58 73.34,18.73 73.03,54.29
  pour Top (isolate 0.406): 76.83,71.12 72.07,71.12 66.99,66.04 66.99,61.59 62.23,61.59 62.23,59.37 65.72,55.88 65.72,43.5 70.17,39.05 69.53,0.64 100.01,0.64 100.01,15.56 88.58,15.56 88.9,75.56 88.58,82.55 81.28,90.17 79.06,92.39 68.26,92.39 68.26,85.09 79.38,85.09 81.6,81.92 81.6,75.56
  pour Bottom (isolate 0.406): 67.31,92.71 67.31,86.04 77.47,86.04 81.92,81.6 81.92,72.71 83.82,70.8 89.22,70.8 89.22,84.45 79.69,92.71
  pour Bottom (isolate 0.406): 60.96,60.96 60.96,57.15 75.25,43.18 87.31,43.18 87.31,47.31 73.66,60.96
  pour Bottom (isolate 0.406): 71.12,35.56 71.12,0.64 99.69,0.64 99.69,15.24 89.22,15.24 89.22,35.24 89.22,35.56
IN1
  Top 0.406: R10.2 81.28,36.83 83.82,34.29 JP-AUDIO.1
IN2
  Top 0.406: R11.2 74.3,31.11 JP-AUDIO.7
INL1
  Top 0.406: R8.2 8.57,35.56 JP-CV.5
INL2  (via drill 0.6 pad 1.02)
  Top 0.406: v19.05,43.81 11.75,43.81 6.03,38.1 JP-CV.4
  Bottom 0.406: v19.05,43.81 23.5,43.81 25.4,41.91 R18.2
INL3
  Bottom 0.406: R30.2 58.42,3.81 56.52,1.91 12.06,1.91 6.99,6.99 6.99,25.4 4.45,27.94 JP-CV.8
INL4
  Top 0.305: 3.81,30.48 5.4,28.89 5.4,20.95
  Top 0.406: R38.2 45.09,5.71 43.18,3.81 10.16,3.81 5.4,8.57 5.4,20.95 | JP-CV.7 3.81,30.48
INL5
  Top 0.406: R39.2 47.62,41.27 42.55,46.35 10.79,46.35 5.08,40.64 JP-CV.3
INL6
  Top 0.406: R31.2 59.69,41.91 58.1,43.5 48.58,43.5 43.81,48.26 8.89,48.26 3.81,43.18 JP-CV.2
INL7
  Bottom 0.406: JP-CV.9 R19.2
INL8
  Top 0.305: 6.99,22.86 6.99,29.84 3.81,33.02
  Top 0.406: R9.2 25.4,10.16 23.81,11.75 14.92,11.75 12.06,14.61 12.06,17.78 6.99,22.86 | JP-CV.6 3.81,33.02
LIN-
  Bottom 0.406: C14.+ 67.31,5.08 74.93,12.7 AUDIORAW.2 89.85,12.7 90.49,12.06 AXO_CORE.LIN-
MIDI/RX
  Bottom 0.406: AXO_CORE.UARTRX 71.39,96.25 71.44,95.89 73.98,93.34 74.3,93.34 80.64,93.34 84.14,89.85 EXT.8
MIDI/TX
  Bottom 0.406: AXO_CORE.UARTTX 73.93,95.93 74.93,94.93 81.92,94.93 84.45,92.39 EXT.6
MISO  (via drill 0.6 pad 1.02)
  Top 0.406: v27.94,73.03 34.29,66.67 U$1.P$12 34.29,59.69 37.78,56.2 57.78,56.2 v59.37,54.61
  Top 0.61: AXO_CORE.PA6 JP1.7 JP2-CONTROL.7
  Bottom 0.406: AXO_CORE.PA6 74.61,40.01 60.01,54.61 v59.37,54.61 | U$2.P$12 17.78,71.12 19.68,73.03 v27.94,73.03
MOSI  (via drill 0.6 pad 1.02)
  Top 0.406: v63.18,48.58 63.18,54.29 59.37,58.1 38.42,58.1 36.83,59.69 U$1.P$11 36.83,67.63 v34.92,69.53
  Top 0.61: JP2-CONTROL.6 JP1.6 AXO_CORE.PA7
  Bottom 0.406: AXO_CORE.PA7 74.3,37.47 v63.18,48.58 | U$2.P$11 18.41,68.58 20.95,71.12 33.34,71.12 v34.92,69.53
N$1
  Top 0.61: L1.2 D1.C
N$2
  Top 0.406: R14.1 R18.1 | C15.1 30.16,40.64 R16.2 27.94,38.1 25.4,35.56 R18.1 | R18.1 25.4,31.11 26.67,29.84 IC2.9
N$3
  Top 0.61: D2.A 37.47,73.03 41.59,68.9 L2.2
N$4
  Top 0.406: R32.3 61.59,84.14 R26.2
N$5
  Top 0.406: C16.1 12.06,7.62 12.06,6.99 R19.1 | IC2.2 16.51,17.78 17.46,16.83 R15.1
  Bottom 0.406: R15.1 17.46,11.43 14.92,8.57 R17.2 14.29,6.99 R19.1
N$6
  Bottom 0.406: IC1.13 73.66,77.47 R22.2 73.03,80.01 72.39,80.64 R26.1
N$7
  Top 0.406: IC1.14 67.94,78.11 R22.1 62.87,71.12 67.31,66.67 67.31,45.72 71.75,41.27 R21.2
N$8
  Bottom 0.406: C13.- 90.17,4.76 R12.2 85.09,3.81 83.19,1.91 AU-IN.2
N$9
  Bottom 0.406: R27.2 79.69,86.36 77.15,88.9 R33.3
N$10
  Bottom 0.406: R23.2 88.27,84.14 85.41,81.28 R27.1 84.77,78.74 83.82,77.79 IC1.9
N$11
  Top 0.406: C11.1 15.56,40.96 R6.2 17.78,38.73 20,36.2 20.32,35.88 R2.1 20.32,31.43 19.37,30.48 17.78,30.48 16.51,29.21 IC2.13
  Bottom 0.305: R8.1 9.21,28.26 11.75,30.8 14.92,30.8 16.51,29.21 IC2.13
N$12  (via drill 0.6 pad 1.02)
  Top 0.406: v87,55.24 88.9,57.15 88.9,72.39 IC1.8
  Bottom 0.406: R20.2 78.74,57.78 81.28,55.24 v87,55.24 | IC1.8 86.68,74.93 88.27,76.52 R23.1
N$13
  Bottom 0.406: IC1.10 81.28,81.6 76.83,86.04 65.41,86.04 62.55,88.9 JP-AU.2
N$14
  Bottom 0.406: IC1.12 76.2,80.64 72.71,84.14 64.45,84.14 60.01,88.58 JP-AU.1
N$15
  Top 0.406: C12.1 29.84,16.51 R7.2 | R7.2 R9.1 R3.1 | IC2.6 26.67,19.05 27.94,17.78 R7.2
N$16
  Top 0.406: C14.- 73.41,2.6 R13.2
  Bottom 0.406: AU-IN.1 75.88,4.45 R13.2
N$17
  Top 0.406: IC1.6 R4.2 R10.1
N$18
  Top 0.406: R36.2 R38.1 47.62,15.88 | IC3.2 50.8,19.05 47.62,15.88 | 47.62,14.61 R34.1 47.62,15.88
  Bottom 0.406: C19.1 40.64,13.97 R36.2
N$19
  Top 0.406: IC1.7 86.36,57.78 83.82,55.24 R4.1 83.82,51.44 88.58,46.67 88.58,8.26 R12.3
N$20
  Top 0.406: IC3.13 50.8,32.38 R35.1 R39.1 47.62,34.29 45.09,36.83 R37.2 40.96,39.37 C20.1
N$21
  Top 0.406: IC1.2 73.66,61.28 74.3,60.64 R11.1 R5.2
N$22
  Top 0.406: R24.1 56.52,15.88 R30.1 R28.2 65.41,15.88 C17.1
  Bottom 0.406: IC3.6 R28.2
N$23  (via drill 0.6 pad 1.02)
  Top 0.406: IC1.1 69.22,65.41 69.22,53.98 R5.1 | R13.3 86.36,15.56 86.36,43.81 v83.82,46.35
  Bottom 0.406: R5.1 71.44,49.53 74.61,46.35 v83.82,46.35
N$24
  Top 0.406: IC3.9 60.96,30.48 59.69,31.75 R31.1 59.69,35.56 62.23,38.1 R29.2
  Bottom 0.406: C18.1 66.67,38.73 64.77,40.64 R29.2 | R25.1 R31.1
N$25
  Top 0.406: D4.C 39.37,87.31 C24.1 33.97,87.31 IC4.IN
N$29
  Top 0.61: JP2-CONTROL.2 JP1.2 AXO_CORE.VDDC
N$32
  Top 0.61: JP2-CONTROL.10 JP1.10 AXO_CORE.VDDA1
N$38
  Top 0.61: JP2-CONTROL.16 JP1.16 AXO_CORE.VDDA
N$42
  Top 0.61: AXO_CORE.PC3 JP1.20 JP2-CONTROL.20
N$43
  Top 0.61: JP2-CONTROL.21 JP1.21 AXO_CORE.PC2
N$44
  Top 0.61: AXO_CORE.PC1 JP1.22 JP2-CONTROL.22
N$45
  Top 0.61: JP2-CONTROL.23 JP1.23 AXO_CORE.PC0
N$50
  Top 0.61: JP2-CONTROL.28 JP1.28 AXO_CORE.PB7
N$51
  Top 0.61: AXO_CORE.PB6 JP1.29 JP2-CONTROL.29
N$56
  Top 0.61: D1.A 10.16,97.79 POWER.10 POWER.9
N$64
  Top 0.61: POWER.1 POWER.2
  Bottom 0.61: D2.C 23.18,84.14 20.95,86.36 POWER.2
NSS
  Top 0.61: AXO_CORE.PA4 JP1.9 JP2-CONTROL.9
OUT1
  Top 0.406: R21.1 78.11,22.23 81.28,25.4 JP-AUDIO.4 JP-AUDIO.3
OUT2
  Top 0.406: R20.1 JP-AUDIO.5 JP-AUDIO.6
PA0/PWM
  Top 0.61: AXO_CORE.PA0 JP1.15 JP2-CONTROL.15
PA1/PWM
  Top 0.61: JP2-CONTROL.14 JP1.14 AXO_CORE.PA1
PA2/TX
  Top 0.61: JP2-CONTROL.13 JP1.13 AXO_CORE.PA2
PA3/RX
  Top 0.61: JP2-CONTROL.12 JP1.12 AXO_CORE.PA3
PB0/PWM
  Top 0.61: AXO_CORE.PB0 JP1.5 JP2-CONTROL.5
PB1/PWM
  Top 0.61: JP2-CONTROL.4 JP1.4 AXO_CORE.PB1
RIN-
  Bottom 0.406: C13.+ 93.34,3.56 93.34,6.03 92.39,6.99 AXO_CORE.RIN- 91.76,7.3 91.12,7.3 88.27,10.16 AUDIORAW.3
SCK
  Top 0.406: U$2.P$13 15.24,73.66 13.65,72.07 13.65,62.87 20,56.52 29.21,56.52 31.75,59.05 U$1.P$13
  Top 0.61: JP2-CONTROL.8 JP1.8 AXO_CORE.PA5
  Bottom 0.406: AXO_CORE.PA5 74.93,42.55 59.37,57.78 33.34,57.78 31.75,59.37 U$1.P$13
SCL
  Top 0.61: AXO_CORE.PB8 JP1.27 JP2-CONTROL.27
  Bottom 0.406: AXO_CORE.PB8 90.81,90.81 89.22,92.39 EXT.5
SDA
  Top 0.61: JP2-CONTROL.26 JP1.26 AXO_CORE.PB9
  Bottom 0.406: AXO_CORE.PB9 90.17,88.27 88.58,89.85 EXT.7
VBUS  (via drill 0.6 pad 1.02)
  Top 0.406: D3.C 55.24,82.23 v64.77,91.76
  Bottom 0.406: D3.C R40.2 50.16,82.23 C23.1 46.99,82.55 45.72,81.28 TP-VBUS.TP | AXO_CORE.VBUS 68.85,95.84 v64.77,91.76
VCC
  Top 0.406: C7.1 75.88,71.75 78.74,68.9 IC1.4
  Top 0.61: C21.+ 46.1,76.14 43.5,78.74 43.5,93.34 D4.A 39.05,97.79 L1.1
  Bottom 0.406: C7.1 66.36,71.75 63.5,74.61 R40.1 52.07,74.3 C21.+
VDD  (via drill 0.6)
  Top 0.406: AXO_CORE.VDD1 67.63,83.19 v66.67,82.23 | R1.1 11.75,60.01 11.75,77.79 15.24,81.28 U$2.P$16 C2.2
  Top 0.61: AXO_CORE.VDD1 JP1.24 JP2-CONTROL.24
  Bottom 0.406: v66.67,82.23 63.82,82.23 62.87,83.19 60.33,83.19 54.61,77.47 TP-VADC.TP 30.8,77.47 26.99,81.28 C2.2 | U$1.P$16 C1.2 18.1,58.42 R1.1
VDD+
  Top 0.61: JP2-CONTROL.30 JP1.30 AXO_CORE.VDD
  Bottom 0.406: EXT.2 EXT.1 88.9,98.42 AXO_CORE.VDD
VDDAA  (via drill 0.6 pad 1.02)
  Top 0.305: C5.1 21.91,78.42 22.86,77.47 C6.+
  Top 0.406: IC2.4 21.59,21.59 24.13,24.13 53.98,24.13 55.88,22.23 IC3.4 | U$2.P$15 16.83,78.74 17.14,78.42 C5.1 | C4.+ 27.3,65.41 C3.1 | R1.2 7.62,58.42 v14.29,51.75
  Bottom 0.305: 26.67,59.37 25.72,58.42 20.95,58.42 v14.29,51.75
  Bottom 0.406: C8.1 20.32,17.78 21.59,19.05 IC2.4 21.59,21.59 18.41,24.77 10.16,24.77 6.67,28.26 6.67,44.13 v14.29,51.75 | IC3.4 55.88,19.05 53.34,16.51 C9.1 | U$2.P$15 13.97,78.74 11.75,76.52 11.75,61.91 8.26,58.42 R1.2 JP-POT.10 | C3.1 U$1.P$15 26.67,59.37
VEE
  Top 0.406: C22.- 52.45,68.52 L2.1 | C10.2 IC1.11
  Top 0.61: L2.1 51.44,67.94 R41.1
  Bottom 0.406: C22.- 68.2,68.52 71.12,71.44 76.83,71.44 78.74,73.34 IC1.11

### Text on the board
Bottom: PCB V1.1
tPlace: + | + | + | CS2 | + | CS1 | TX | UART | RX | NSS | SCLK | SPI | MISO | MOSI | AUDIO I/O | CM | LIN- | RIN- | + | +
bPlace: VDD | GND | TX | RX | CS2 | CS1 | TX | RX | UART | NSS | SCLK | SPI | MISO | MOSI | CM | CM | O | G | G | L | R | L | R
tNames: PCB V1.1 | RIGHT | LEFT | RIGHT | LEFT | IC5 | 0 | 1 | 2 | 3 | 4 | 5 | 6 | 7 | PGND | F-VDD | IC6 | CVGND | 6 | 5 | 2 | 0 | 3 | in1 | out1 | out2 | in2 | 4 | 7 | 1 | LIN - | RIN -
bNames: AXO POWER | TIP | RING | FROM | AXO | EUXOLOTI | CORE | AXOLOTI | created by Paul | www.irieelectronics.de | CC-BY-NC-SA